# Altium schematic sheet Audio.SchDoc
size A4; SheetNumber: 3; SheetTotal: 6
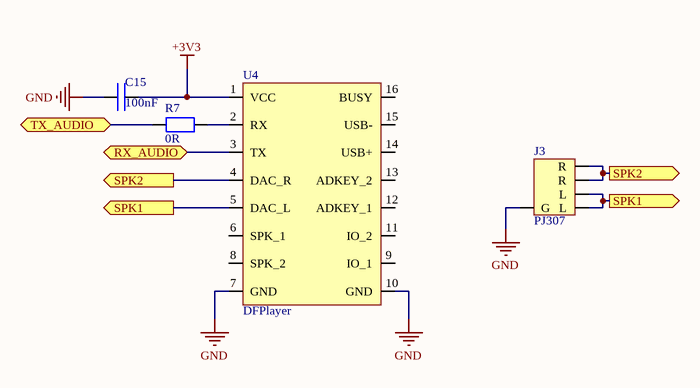
[diagram p0: Audio.SchDoc]

## Parts
C15  100nF  [C0603]
J3  PJ307  [PJ307]
R7  0R  [R0603]
U4  DFPlayer  [DFPLAYER]

## Ports
RX_AUDIO (bidir), SPK1 (out), SPK2 (out), TX_AUDIO (bidir)

## Nets
+3V3: C15.2 U4.1(VCC)
GND: C15.1 J3.1(G) U4.7(GND) U4.10(GND)
RX_AUDIO: U4.3(TX) ; port RX_AUDIO
SPK1: J3.2(L) J3.3(L) U4.5(DAC_L) ; port SPK1
SPK2: J3.4(R) J3.5(R) U4.4(DAC_R) ; port SPK2
TX_AUDIO: R7.1 ; port TX_AUDIO
NetR7_2: R7.2 U4.2(RX)

Not connected (* = marked no-connect by the designer): U4 6(SPK_1) 8(SPK_2) 9(IO_1) 11(IO_2) 12(ADKEY_1) 13(ADKEY_2) 14(USB+) 15(USB-) 16(BUSY)

## Library data of the parts
C15 = Cap_SMD
J3 = Jack_3.5mm_PJ307
R7 = Res